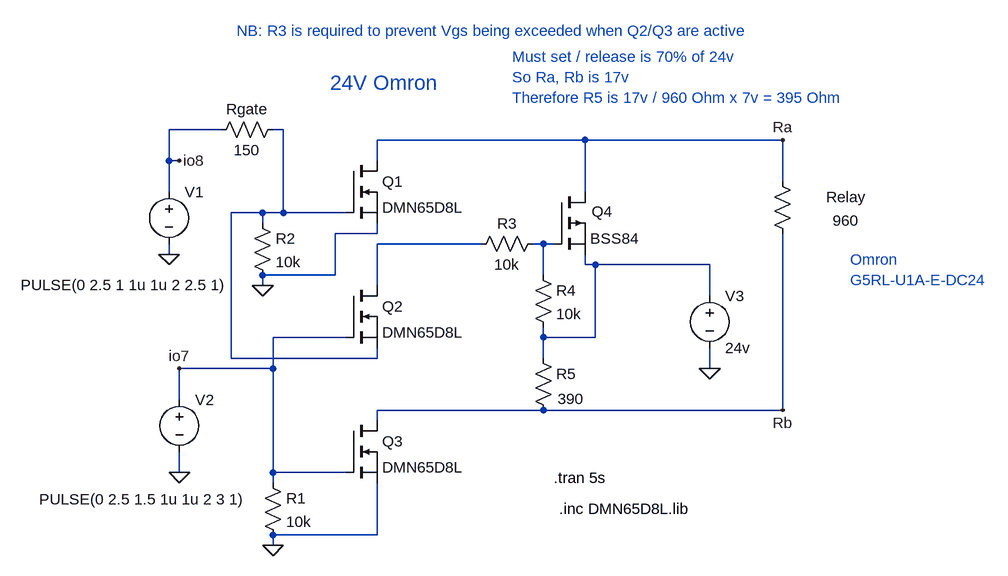
[diagram p0: schematic RON03_24v_Omron_BackEMF.asc]
RON03_24v_Omron_BackEMF.asc, the LTspice schematic file:
Version 4
SHEET 1 1348 680
WIRE -112 -432 -192 -432
WIRE -16 -432 -32 -432
WIRE 448 -416 128 -416
WIRE 752 -416 448 -416
WIRE -192 -384 -192 -432
WIRE -176 -384 -192 -384
WIRE 128 -384 128 -416
WIRE 752 -352 752 -416
WIRE -192 -336 -192 -384
WIRE 448 -336 448 -416
WIRE -48 -304 -96 -304
WIRE -16 -304 -16 -432
WIRE -16 -304 -48 -304
WIRE 80 -304 -16 -304
WIRE -48 -288 -48 -304
WIRE 128 -272 128 -288
WIRE 128 -272 64 -272
WIRE 288 -256 128 -256
WIRE 384 -256 368 -256
WIRE 400 -256 384 -256
WIRE -192 -240 -192 -256
WIRE 448 -224 448 -240
WIRE 464 -224 448 -224
WIRE 640 -224 464 -224
WIRE 64 -208 64 -272
WIRE 64 -208 -48 -208
WIRE 384 -208 384 -256
WIRE -48 -192 -48 -208
WIRE 128 -192 128 -256
WIRE 640 -176 640 -224
WIRE 80 -112 -32 -112
WIRE 384 -112 384 -128
WIRE 464 -112 464 -224
WIRE 464 -112 384 -112
WIRE -96 -80 -96 -304
WIRE 128 -80 128 -96
WIRE 128 -80 -96 -80
WIRE 384 -80 384 -112
WIRE -32 -64 -32 -112
WIRE -32 -64 -176 -64
WIRE 640 -64 640 -96
WIRE -176 -16 -176 -64
WIRE 384 0 128 0
WIRE 752 0 752 -272
WIRE 752 0 384 0
WIRE 128 16 128 0
WIRE -176 96 -176 64
WIRE -32 96 -32 -64
WIRE 80 96 -32 96
WIRE -32 112 -32 96
WIRE 128 192 128 112
WIRE 128 192 -32 192
WIRE -32 208 -32 192
FLAG -48 -192 0
FLAG -32 208 0
FLAG 640 -64 0
FLAG -192 -240 0
FLAG -176 96 0
FLAG -176 -384 io8
FLAG -176 -64 io7
FLAG 752 -416 Ra
FLAG 752 0 Rb
SYMBOL res -64 -304 R0
SYMATTR InstName R2
SYMATTR Value 10k
SYMBOL res -48 96 R0
SYMATTR InstName R1
SYMATTR Value 10k
SYMBOL res 368 -96 R0
WINDOW 3 38 79 Left 2
SYMATTR Value 390
SYMATTR InstName R5
SYMBOL pmos 400 -336 R0
WINDOW 0 58 30 Left 2
SYMATTR InstName Q4
SYMATTR Value BSS84
SYMBOL nmos 80 -192 R0
SYMATTR InstName Q2
SYMATTR Value DMN65D8L
SYMATTR Prefix X
SYMBOL nmos 80 16 R0
SYMATTR InstName Q3
SYMATTR Value DMN65D8L
SYMATTR Prefix X
SYMBOL nmos 80 -384 R0
SYMATTR InstName Q1
SYMATTR Value DMN65D8L
SYMATTR Prefix X
SYMBOL res 736 -368 R0
WINDOW 0 83 40 Left 2
WINDOW 3 93 76 Left 2
SYMATTR InstName Relay
SYMATTR Value 960
SYMATTR SpiceLine pwr=5
SYMBOL res 368 -224 R0
SYMATTR InstName R4
SYMATTR Value 10k
SYMBOL voltage -192 -352 R0
WINDOW 3 -228 159 Left 2
WINDOW 123 0 0 Left 0
WINDOW 39 0 0 Left 0
SYMATTR Value PULSE(0 2.5 1 1u 1u 2 2.5 1)
SYMATTR InstName V1
SYMBOL voltage -176 -32 R0
WINDOW 3 -216 169 Left 2
WINDOW 123 0 0 Left 0
WINDOW 39 0 0 Left 0
SYMATTR Value PULSE(0 2.5 1.5 1u 1u 2 3 1)
SYMATTR InstName V2
SYMBOL voltage 640 -192 R0
WINDOW 123 0 0 Left 0
WINDOW 39 0 0 Left 0
SYMATTR InstName V3
SYMATTR Value 24v
SYMBOL res 384 -272 R90
WINDOW 0 0 56 VBottom 2
WINDOW 3 32 56 VTop 2
SYMATTR InstName R3
SYMATTR Value 10k
SYMBOL res -16 -448 R90
WINDOW 0 0 56 VBottom 2
WINDOW 3 32 56 VTop 2
SYMATTR InstName Rgate
SYMATTR Value 150
TEXT 400 104 Left 2 !.tran 5s
TEXT 856 -232 Left 2 ;Omron\nG5RL-U1A-E-DC24
TEXT 336 -544 Left 2 ;Must set / release is 70% of 24v\nSo Ra, Rb is 17v\nTherefore R5 is 17v / 960 Ohm x 7v = 395 Ohm
TEXT 56 -504 Left 3 ;24V Omron
TEXT 408 152 Left 2 !.inc DMN65D8L.lib
TEXT -88 -584 Left 2 ;NB: R3 is required to prevent Vgs being exceeded when Q2/Q3 are active

The netlist it stands for:
* RON03_24v_Omron_BackEMF.asc
R2 N001 0 10k
R1 io7 0 10k
R5 N004 Rb 390
M§Q4 Ra N003 N004 N004 BSS84
XQ2 N002 io7 N001 DMN65D8L  ; pins D G S
XQ3 Rb io7 0 DMN65D8L  ; pins D G S
XQ1 Ra N001 0 DMN65D8L  ; pins D G S
Relay Ra Rb 960 pwr=5
R4 N003 N004 10k
V1 io8 0 PULSE(0 2.5 1 1u 1u 2 2.5 1)
V2 io7 0 PULSE(0 2.5 1.5 1u 1u 2 3 1)
V3 N004 0 24v
R3 N003 N002 10k
Rgate N001 io8 150
.model NMOS NMOS
.model PMOS PMOS
.lib standard.mos
.tran 5s
* Omron
* G5RL-U1A-E-DC24
* Must set / release is 70% of 24v
* So Ra, Rb is 17v
* Therefore R5 is 17v / 960 Ohm x 7v = 395 Ohm
* 24V Omron
.inc DMN65D8L.lib
* NB: R3 is required to prevent Vgs being exceeded when Q2/Q3 are active
.backanno
.end